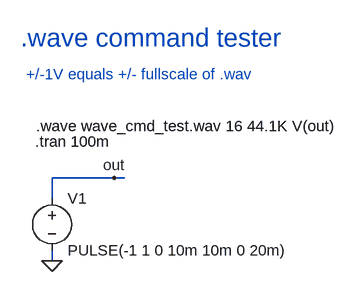
[diagram p0: schematic wave_cmd_test.asc]
wave_cmd_test.asc, the LTspice schematic file:
Version 4
SHEET 1 880 680
WIRE 240 96 144 96
WIRE 256 96 240 96
WIRE 144 128 144 96
WIRE 144 224 144 208
FLAG 144 224 0
FLAG 240 96 out
SYMBOL voltage 144 112 R0
WINDOW 123 0 0 Left 0
WINDOW 39 0 0 Left 0
SYMATTR InstName V1
SYMATTR Value PULSE(-1 1 0 10m 10m 0 20m)
TEXT 118 40 Left 2 !.tran 100m
TEXT 120 16 Left 2 !.wave wave_cmd_test.wav 16 44.1K V(out)
TEXT 96 -120 Left 4 ;.wave command tester
TEXT 104 -64 Left 2 ;+/-1V equals +/- fullscale of .wav

The netlist it stands for:
* wave_cmd_test.asc
V1 out 0 PULSE(-1 1 0 10m 10m 0 20m)
.tran 100m
.wave wave_cmd_test.wav 16 44.1K V(out)
* .wave command tester
* +/-1V equals +/- fullscale of .wav
.backanno
.end